# EAGLE design TestBoard (EAGLE 9.1.1)

## Sheet 1 of 2
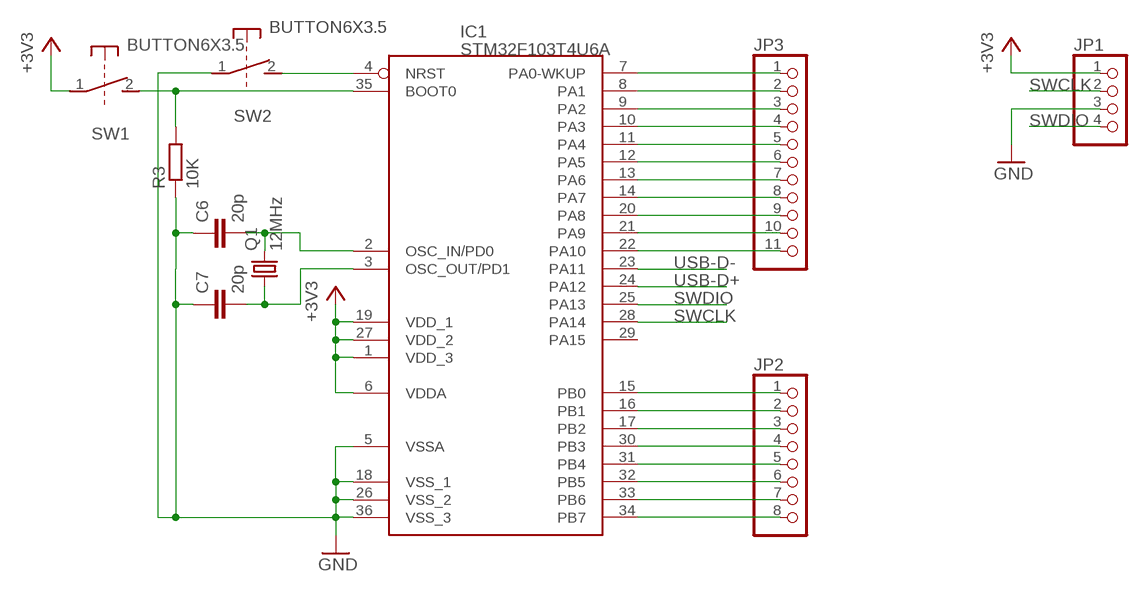
[diagram p0: schematic, sheet 1]

### Parts
C6  20p  CAP_0805  [CAP0805]
C7  20p  CAP_0805  [CAP0805]
IC1  STM32F103T4U6A  [QFN50P606X606X100-36]
JP1  PINHD-1X4  [1X04]
JP2  PINHD-1X8  [1X08]
JP3  PINHD-1X11  [1X11]
Q1  12MHz  CRYSTALHC49UP  [HC49UP]
R3  10K  R_R0805  [RESC2012X50]
SW1  BUTTON6X3.5  [SW-6X3.5]
SW2  BUTTON6X3.5  [SW-6X3.5]

### Nets
+3V3: IC1.1(VDD_3) IC1.6(VDDA) IC1.19(VDD_1) IC1.27(VDD_2) JP1.1 SW1.1 ; also sheet 2
GND: C6.1 C7.1 IC1.5(VSSA) IC1.18(VSS_1) IC1.26(VSS_2) IC1.36(VSS_3) JP1.3 R3.1 SW2.1 ; also sheet 2
N$2: C7.2 IC1.3(OSC_OUT/PD1) Q1.1
N$3: C6.2 IC1.2(OSC_IN/PD0) Q1.2
N$4: IC1.35(BOOT0) R3.2 SW1.2
N$5: IC1.4(NRST) SW2.2
N$6: IC1.15(PB0) JP2.1
N$7: IC1.16(PB1) JP2.2
N$8: IC1.17(PB2) JP2.3
N$9: IC1.30(PB3) JP2.4
N$10: IC1.31(PB4) JP2.5
N$11: IC1.32(PB5) JP2.6
N$12: IC1.33(PB6) JP2.7
N$13: IC1.34(PB7) JP2.8
N$14: IC1.7(PA0-WKUP) JP3.1
N$15: IC1.8(PA1) JP3.2
N$16: IC1.9(PA2) JP3.3
N$17: IC1.10(PA3) JP3.4
N$18: IC1.11(PA4) JP3.5
N$19: IC1.12(PA5) JP3.6
N$20: IC1.13(PA6) JP3.7
N$21: IC1.14(PA7) JP3.8
N$22: IC1.20(PA8) JP3.9
N$23: IC1.21(PA9) JP3.10
N$24: IC1.22(PA10) JP3.11
SWCLK: IC1.28(PA14) JP1.2
SWDIO: IC1.25(PA13) JP1.4
USB-D+: IC1.24(PA12) ; also sheet 2
USB-D-: IC1.23(PA11) ; also sheet 2
Unconnected: IC1.29(PA15)

## Sheet 2 of 2
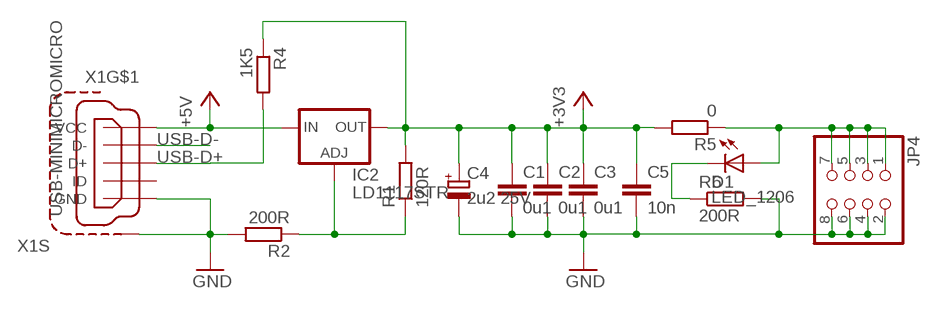
[diagram p1: schematic, sheet 2]

### Parts
C1  0u1  CAP_0805  [CAP0805]
C2  0u1  CAP_0805  [CAP0805]
C3  0u1  CAP_0805  [CAP0805]
C4  2u2 25V  CAP-POL_CAPE3216-A  [CAPMP3317X180]
C5  10n  CAP_0805  [CAP0805]
D1  LED_1206  [LED1206]
IC2  LD1117STR  VREG-ADJLD1117S  [SOT230P700X180-4]
JP4  PINHD-2X4  [2X04]
R1  120R  R_R0805  [RESC2012X50]
R2  200R  R_R0805  [RESC2012X50]
R4  1K5  R_R0805  [RESC2012X50]
R5  0  R_R0805  [RESC2012X50]
R6  200R  R_R0805  [RESC2012X50]
X1  USB-MINIMICROMICRO  [USB-B-MICRO-SMD]

### Nets
+3V3: C1.1 C2.1 C3.1 C4.1(+) C5.1 IC2.2(OUT) IC2.4(OUT) R1.2 R4.1 R5.2 ; also sheet 1
+5V: IC2.3(IN) X1.VBUS(VCC)
GND: C1.2 C2.2 C3.2 C4.2(-) C5.2 JP4.2 JP4.4 JP4.6 JP4.8 R2.2 R6.2 X1.GND X1.SHIELD1(S:S1) X1.SHIELD2(S:S1) X1.SHIELD3(S:S1) ; also sheet 1
N$1: IC2.1(ADJ) R1.1 R2.1
N$25: D1.A JP4.1 JP4.3 JP4.5 JP4.7 R5.1
N$26: D1.C R6.1
USB-D+: R4.2 X1.D+ ; also sheet 1
USB-D-: X1.D- ; also sheet 1
Unconnected: X1.ID

## Library data of the parts
C1-C3 C5-C7 = Flamberm:CAP_
C4 = Flamberm:CAP-POL_
D1 = Flamberm:LED_
IC1 = Flamberm:STM32F103T4U6A
IC2 = Flamberm:VREG-ADJ: VOLTAGE REGULATOR
JP1 = pinhead:PINHD-1X4: PIN HEADER
JP2 = pinhead:PINHD-1X8: PIN HEADER
JP3 = pinhead:PINHD-1X11: PIN HEADER
JP4 = pinhead:PINHD-2X4: PIN HEADER
Q1 = crystal:CRYSTAL: CRYSTAL; OC_FARNELL: unknown; OC_NEWARK: unknown
R1-R6 = Flamberm:R_
SW1 SW2 = Flamberm:BUTTON
X1 = Flamberm:USB-MINIMICRO: MINI USB-B Conector Source: www.cypressindustries.com

## Board
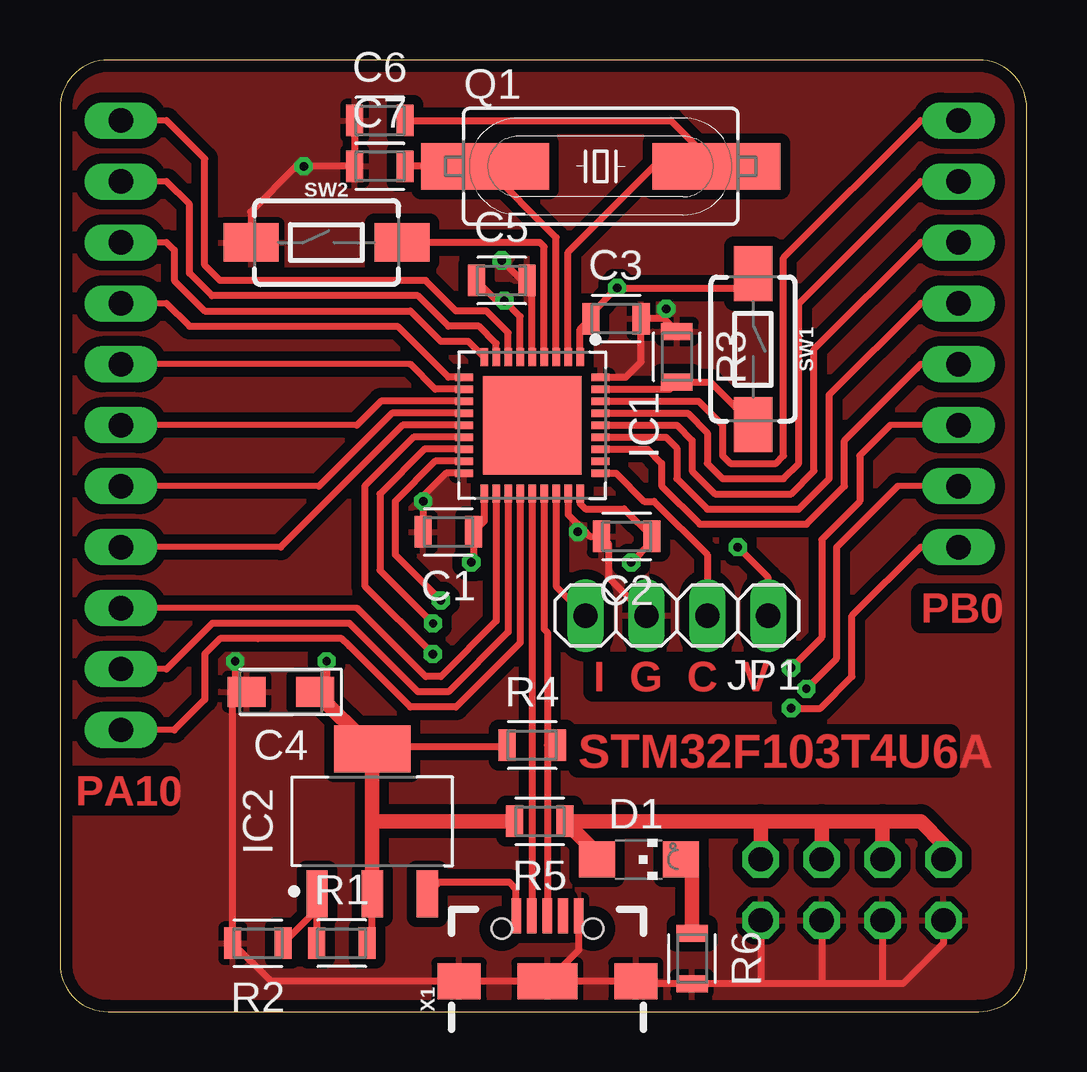
[diagram p2: board, top side]
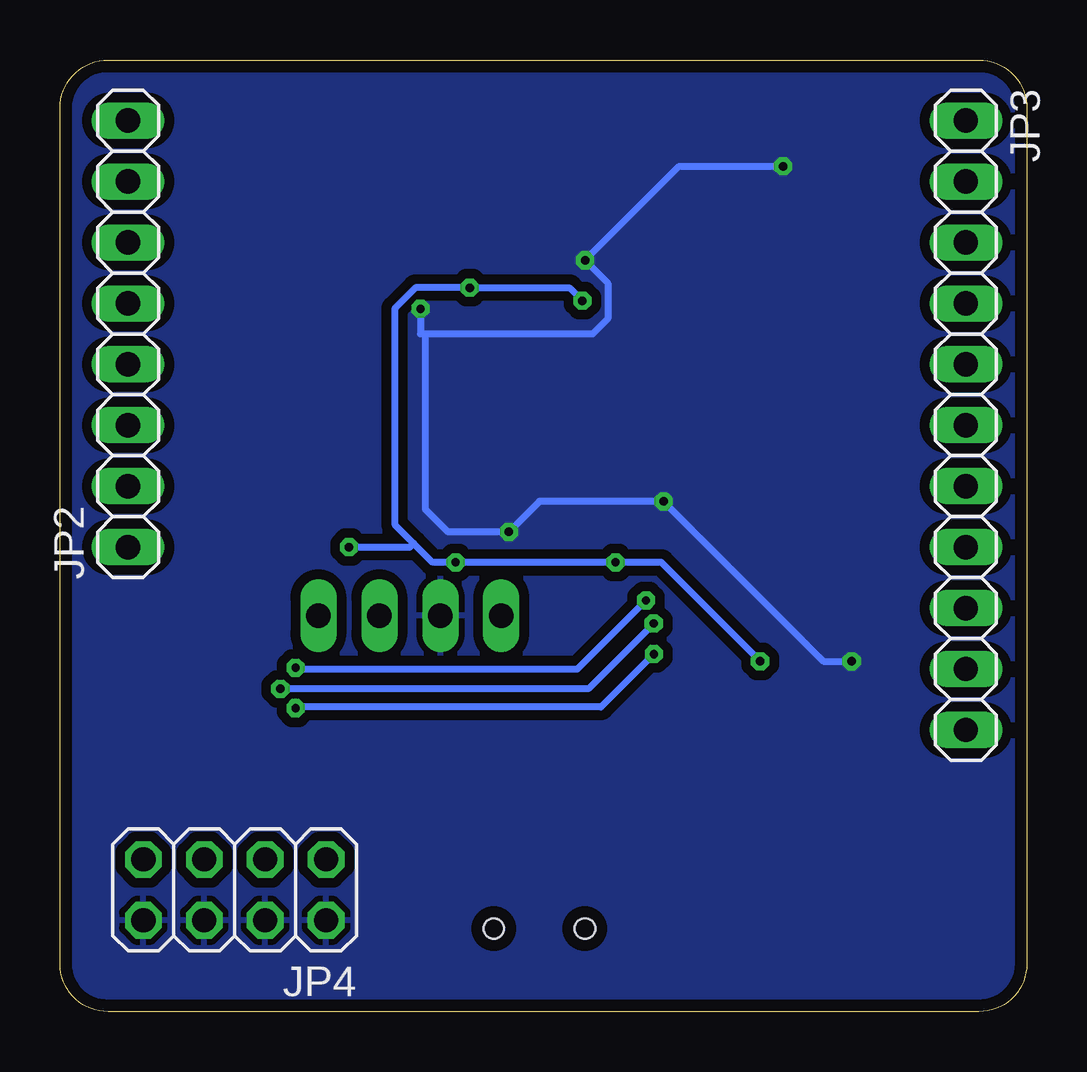
[diagram p3: board, bottom side, seen from below]

Size 40.3 x 39.67 mm. Coordinates in mm from the lower left corner, seen from the top.
Outline: 38.3,39.67 2,39.67 arc90 0,37.67 0,2 arc90 2,0 38.3,0 arc90 40.3,2 40.3,37.67 arc90 38.3,39.67
Copper layers (1*16): Top 0.035mm / dielectric 1.5mm / Bottom 0.035mm
Design rules "EagleDesignRules *": minimum track width 0.25mm, minimum drill 0.3mm, track to track 0.2mm, track to pad 0.2mm, pad to pad 0.2mm, via to via 0.2mm, smd to smd 0.2mm, copper to edge 0.5mm, drill to drill 0.5mm, minimum pad ring 10mil, minimum via ring 8mil, stop-mask expansion 4mil, vias tented up to drill 0mil, thermal gap 0.25mm

### Footprints (pad centres in the part's own frame; a part is rotated, then mirrored left to right if it is on the bottom)
CAP0805 = smd 0.712 x 1.312: 1 -1.05,0; 2 1.05,0
CAPMP3317X180 = smd 1.579 x 1.25: 1 -1.425,0; 2 1.425,0
LED1206 = smd 1.5 x 1.5: A 0,-1.75; C 0,1.75
QFN50P606X606X100-36 = smd 0.75 x 0.3: 1 -2.838,2; 2 -2.838,1.5; 3 -2.838,1; 4 -2.838,0.5; 5 -2.838,0; 6 -2.838,-0.5; 7 -2.838,-1; 8 -2.838,-1.5; 9 -2.838,-2; 19 2.838,-2; 20 2.838,-1.5; 21 2.838,-1; 22 2.838,-0.5; 23 2.838,0; 24 2.838,0.5; 25 2.838,1; 26 2.838,1.5; 27 2.838,2 | smd 0.3 x 0.75: 10 -2,-2.838; 11 -1.5,-2.838; 12 -1,-2.838; 13 -0.5,-2.838; 14 0,-2.838; 15 0.5,-2.838; 16 1,-2.838; 17 1.5,-2.838; 18 2,-2.838; 28 2,2.838; 29 1.5,2.838; 30 1,2.838; 31 0.5,2.838; 32 0,2.838; 33 -0.5,2.838; 34 -1,2.838; 35 -1.5,2.838; 36 -2,2.838 | smd 4.1 x 4.1: P$1 0,0
SOT230P700X180-4 = smd 1.965 x 0.889: 1 -3.023,2.3; 2 -3.023,0; 3 -3.023,-2.3 | smd 1.965 x 3.189: 4 3.023,0
1X04 = drill 1.016 long: 1 -3.81,0; 2 -1.27,0; 3 1.27,0; 4 3.81,0
1X08 = drill 1.016 long: 1 -8.89,0; 2 -6.35,0; 3 -3.81,0; 4 -1.27,0; 5 1.27,0; 6 3.81,0; 7 6.35,0; 8 8.89,0
1X11 = drill 1.016 long: 1 -12.7,0; 2 -10.16,0; 3 -7.62,0; 4 -5.08,0; 5 -2.54,0; 6 0,0; 7 2.54,0; 8 5.08,0; 9 7.62,0; 10 10.16,0; 11 12.7,0
2X04 = drill 1.016 octagon: 1 -3.81,-1.27; 2 -3.81,1.27; 3 -1.27,-1.27; 4 -1.27,1.27; 5 1.27,-1.27; 6 1.27,1.27; 7 3.81,-1.27; 8 3.81,1.27
HC49UP = smd 5.334 x 1.93: 1 -4.826,0; 2 4.826,0
RESC2012X50 = smd 0.712 x 1.312: 1 -1.05,0; 2 1.05,0
SW-6X3.5 = smd 2.3 x 1.6: 1 -3.15,0; 2 3.15,0
USB-B-MICRO-SMD = smd 1.45 x 0.4: D+ 2.725,0; D- 2.725,0.65; GND 2.725,-1.3; ID 2.725,-0.65; VBUS 2.725,1.3 | smd 1.5 x 1.8: SHIELD1 0,3.685; SHIELD2 0,-3.685 | smd 1.5 x 2.5: SHIELD3 0,0 | hole 0.85: 2.2,1.9; 2.2,-1.9

### Placement (x,y rotation side)
C1  16.19,20 180 top
C2  23.62,19.81 180 top
C3  23.18,28.89 0 top
C4  9.21,13.34 180 top
C5  18.41,30.48 0 top
C6  13.34,37.15 0 top
C7  13.34,35.24 0 top
D1  24.13,6.35 270 top
IC1  19.68,24.45 270 top
IC2  13.02,7.94 90 top
JP1  25.72,16.51 180 top
JP2  37.47,28.26 90 bottom
JP3  2.54,24.45 270 bottom
JP4  33.02,5.08 180 bottom
Q1  22.54,35.24 0 top
R1  11.75,2.86 0 top
R2  8.26,2.86 180 top
R3  25.72,27.3 270 top
R4  19.68,11.11 0 top
R5  20,7.94 180 top
R6  26.35,2.22 270 top
SW1  28.89,27.62 270 top
SW2  11.11,32.07 0 top
X1  20.32,1.27 90 top

### Tracks (layer width: path | path; a pad name or v marks a point on that pad's centre or on a via)
+3V3  (via drill 0.35)
  Top 0.3: R1.2 13.02,3.08 IC2.2 | IC1.27 21.68,21.18 21.9,20.96 23.52,20.96 C2.1 24.67,19.59 v23.81,18.73 | IC1.1 21.68,28.45 C3.1 22.13,29.08 v23.22,30.18 23.22,30.16 28.28,30.16 SW1.1 | IC1.19 17.68,20.45 C1.1 17.24,18.83 v17.14,18.73 | IC1.6 19.18,28.98 v18.52,29.64 18.21,29.64 C5.1 | v11.11,14.61 11.11,13.81 C4.1 10.64,13.34 | IC2.4 12.94,11.04 18.56,11.04 arc90 R4.1 | JP1.1 29.53,18.1 v28.26,19.37
  Top 0.61: IC2.2 13.02,7.94 | 13.02,7.94 IC2.4 | 12.94,11.04 10.64,13.34 | R5.2 13.02,7.94
  Bottom 0.3: v18.52,29.64 19.07,30.18 v23.22,30.18 25.48,30.18 26.35,29.31 26.35,21.59 26.35,21.27 26.35,20.32 25.56,19.53 | 25.56,19.53 24.77,18.73 v23.81,18.73 v17.14,18.73 15.24,18.73 v11.11,14.61 | v28.26,19.37 25.72,19.37 25.56,19.53
+5V
  Top 0.3: X1.VBUS 19.02,5.11 18.73,5.4 15.8,5.4 IC2.3
GND  (via drill 0.35)
  Top 0.3: X1.SHIELD3 X1.SHIELD2 24.1,1.17 R6.2 29.21,1.17 | X1.SHIELD3 X1.SHIELD1 8.79,1.27 R2.2 7.21,12.76 C4.2 7.3,13.81 v7.3,14.61 | X1.GND 21.62,2.57 X1.SHIELD3 | IC1.36 23.59,26.45 24.23,27.09 C3.2 25.18,28.89 | IC1.18 16.1,22.45 15.14,21.49 v15.14,21.27 C1.2 | IC1.5 19.68,30.26 C5.2 19.26,30.48 v18.41,31.32 | C6.1 C7.1 v10.16,35.24 9.84,35.24 7.94,33.34 7.96,33.31 SW2.1 | R3.1 25.18,28.89 | v21.59,20 21.91,20 | 25.18,28.89 25.18,29.21 v25.27,29.31 | JP1.3 22.86,18.1 22.86,19.52 C2.2 22.1,19.81 21.91,20 | IC1.26 21.18,20.73 21.91,20 | 34.29,1.17 35.15,1.17 36.83,2.86 JP4.8 | 34.29,1.17 31.75,1.17 | 31.75,1.17 29.21,1.17 | JP4.2 29.21,1.17 | JP4.4 31.75,1.17 | JP4.6 34.29,1.17
  Bottom 0.3: v25.27,29.31 25.27,28.26 25.08,28.26 | 25.08,28.26 25.08,20.95 24.13,20 v21.59,20 20.32,21.27 19.05,21.27 v15.14,21.27 8.47,14.61 v7.3,14.61 | v10.16,35.24 14.49,35.24 v18.41,31.32 17.46,30.37 17.46,28.89 18.1,28.26 25.08,28.26
  pour Top (isolate 0.406): 38.32,0 arc90 40.32,2 40.32,35.56 40.32,37.69 arc90 38.32,39.69 3.17,39.69 2,39.69 arc90 0,37.69 0,3.17 0,2 arc90 2,0 3.17,0
  pour Bottom (isolate 0.406): 14.29,0 38.32,0 arc90 40.32,2 40.32,18.41 40.32,37.69 arc90 38.32,39.69 16.19,39.69 2,39.69 arc90 0,37.69 0,19.68 0,2 arc90 2,0
N$1
  Top 0.3: R2.1 10.72,4.27 IC2.1 10.7,4.89 R1.1
N$2
  Top 0.3: IC1.3 20.68,32.27 Q1.1 C7.2
N$3
  Top 0.3: IC1.2 21.18,31.66 24.77,35.24 Q1.2 25.46,37.15 C6.2
N$4
  Top 0.3: IC1.35 25.41,25.95 R3.2 27.11,26.25 SW1.2
N$5
  Top 0.3: IC1.4 20.18,31.89 20,32.07 SW2.2
N$6  (via drill 0.35)
  Top 0.25: JP2.1 35.88,19.37
  Top 0.3: IC1.15 14.74,23.95 12.7,21.91 12.7,17.75 v15.54,14.91 | v30.48,12.65 31.7,12.65 33.02,13.97 33.02,16.51 35.88,19.37
  Bottom 0.3: v15.54,14.91 17.75,12.7 30.43,12.7 v30.48,12.65
N$7  (via drill 0.35)
  Top 0.25: JP2.2 34.92,21.91
  Top 0.3: IC1.16 15.19,23.45 13.34,21.59 13.34,18.4 v15.55,16.19 | v31.11,13.46 32.38,14.73 32.38,19.37 34.92,21.91
  Bottom 0.3: v15.55,16.19 18.27,13.46 v31.11,13.46
N$8  (via drill 0.35)
  Top 0.25: JP2.3 34.61,24.45
  Top 0.3: IC1.17 15.64,22.95 13.97,21.27 13.97,19.05 v15.88,17.14 | 34.61,24.45 33.34,23.18 33.34,21.27 31.75,19.68 31.75,15.61 v30.48,14.34
  Bottom 0.3: v15.88,17.14 18.73,14.29 30.43,14.29 v30.48,14.34
N$9
  Top 0.25: JP2.4 35.88,26.99 35.72,26.83
  Top 0.3: IC1.30 24.5,23.45 25.08,22.86 25.08,21.92 26.68,20.33 31.12,20.33 32.7,21.91 32.7,23.81 35.72,26.83 35.88,26.99
N$10
  Top 0.25: JP2.5 35.88,29.53
  Top 0.3: IC1.31 25.27,23.95 25.72,23.5 25.72,22.23 26.99,20.95 30.8,20.95 32.07,22.23 32.07,25.72 35.88,29.53
N$11
  Top 0.25: JP2.6 35.88,32.07
  Top 0.3: IC1.32 25.72,24.45 26.35,23.81 26.35,22.54 27.3,21.59 30.48,21.59 31.43,22.54 31.43,27.62 35.88,32.07
N$12
  Top 0.25: JP2.7 35.88,34.61
  Top 0.3: IC1.33 26.17,24.95 26.99,24.13 26.99,22.86 27.62,22.23 30.16,22.23 30.8,22.86 30.8,29.53 35.88,34.61
N$13
  Top 0.25: JP2.8 35.88,37.15
  Top 0.3: IC1.34 26.62,25.45 27.62,24.45 27.62,23.18 27.94,22.86 29.84,22.86 30.16,23.18 30.16,31.43 35.88,37.15
N$14
  Top 0.25: 4.45,37.15 JP3.1
  Top 0.3: IC1.7 18.68,28.3 17.78,29.21 16.51,29.21 15.24,30.48 6.67,30.48 6.03,31.11 6.03,35.56 4.45,37.15
N$15
  Top 0.25: 4.45,34.61 JP3.2
  Top 0.3: IC1.8 18.18,27.85 17.46,28.57 16.19,28.57 14.92,29.84 6.34,29.84 5.4,30.79 5.4,33.66 4.45,34.61
N$16
  Top 0.25: 4.45,32.07 JP3.3
  Top 0.3: IC1.9 17.03,27.94 15.88,27.94 14.61,29.21 6.03,29.21 4.76,30.48 4.76,31.75 4.45,32.07
N$17
  Top 0.25: 4.45,29.53 JP3.4
  Top 0.3: IC1.10 16.19,26.45 14.06,28.57 5.4,28.57 4.45,29.53
N$18
  Top 0.25: 14.61,26.99 JP3.5
  Top 0.3: IC1.11 15.64,25.95 14.61,26.99
N$19
  Top 0.25: 12.38,24.45 JP3.6
  Top 0.3: IC1.12 13.38,25.45 12.38,24.45
N$20
  Top 0.25: 10.79,21.91 JP3.7
  Top 0.3: IC1.13 13.84,24.95 10.79,21.91
N$21
  Top 0.25: 9.21,19.37 JP3.8
  Top 0.3: IC1.14 14.29,24.45 9.21,19.37
N$22
  Top 0.25: 12.38,16.83 JP3.9
  Top 0.3: IC1.20 18.18,16.28 15.88,13.97 15.24,13.97 12.38,16.83
N$23
  Top 0.25: 4.45,14.29 JP3.10
  Top 0.3: IC1.21 18.68,15.83 16.19,13.34 14.92,13.34 12.06,16.19 6.35,16.19 4.45,14.29
N$24
  Top 0.25: 4.76,11.75 JP3.11
  Top 0.3: IC1.22 19.18,15.38 16.51,12.7 14.61,12.7 12.06,15.24 11.75,15.56 8.26,15.56 6.67,15.56 6.03,14.92 6.03,13.02 4.76,11.75
N$25
  Top 0.3: 22.38,6.61 D1.A
  Top 0.61: 22.38,6.61 R5.1 29.21,7.94 | 29.21,7.94 31.75,7.94 | 31.75,7.94 34.29,7.94 | 34.29,7.94 35.88,7.94 36.83,6.99 JP4.7 | JP4.5 34.29,7.94 | JP4.3 31.75,7.94 | JP4.1 29.21,7.94
N$26
  Top 0.3: D1.C 26.35,5.88
  Top 0.61: 26.35,5.88 R6.1
SWCLK
  Top 0.3: IC1.28 23.18,22.45 24.35,21.27 24.77,21.27 26.99,19.05 JP1.2
SWDIO
  Top 0.3: IC1.25 20.68,17.73 JP1.4
USB-D+
  Top 0.3: IC1.24 20.18,15.96 20.32,15.82 20.32,11.11 | 20.32,11.11 X1.D+ | R4.2 20.32,11.11
USB-D-
  Top 0.3: X1.D- arc90 19.68,4.01 IC1.23

### Text on the board
Top: PB0 | I G C V | STM32F103T4U6A | PA10